# Altium schematic sheet CIBLE_Main.SchDoc
size 151 x 193 mm
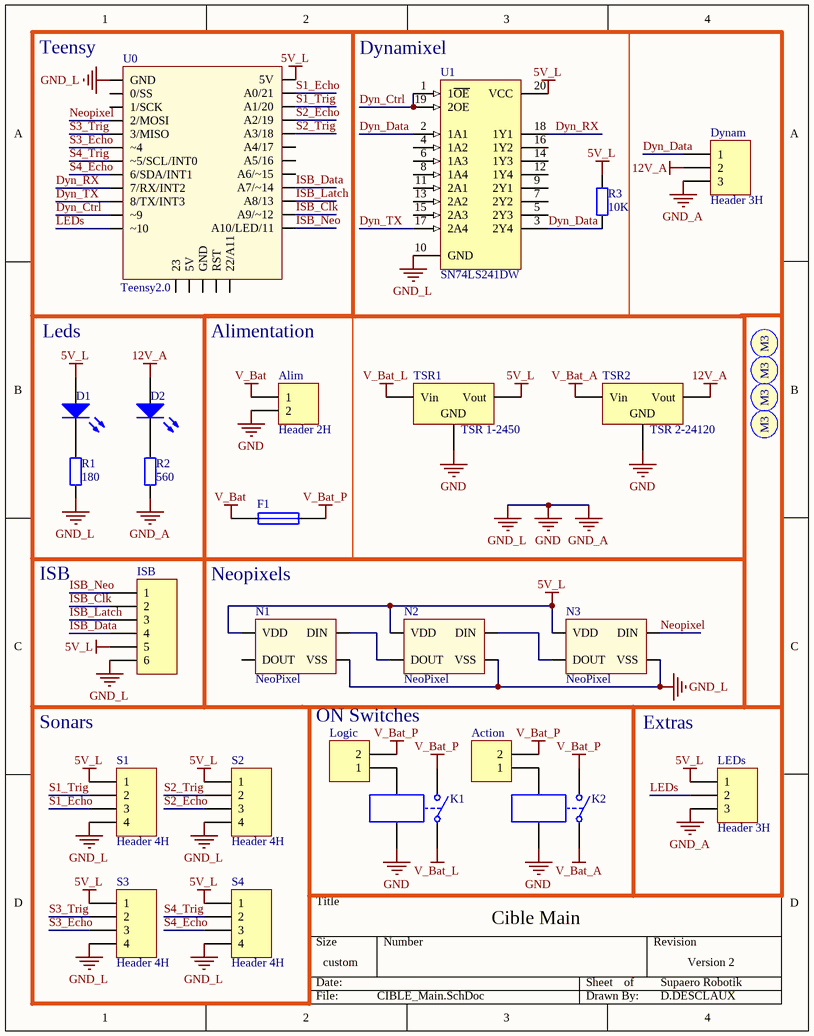
[diagram p0: CIBLE_Main.SchDoc]

## Parts
Action  Action  [Molex SPOX 2x1H]  (value not drawn)
Alim  Header 2H  [Battery SALE]
D1  KP-3216SEC  [3.2X1.6X1.1]  (value not drawn)
D2  KP-3216SEC  [3.2X1.6X1.1]  (value not drawn)
Dynam  Header 3H  [Molex SPOX 3x1H]
F1  Fuse 1  [Fuse]  (value not drawn)
ISB  Header 6H  [MOLEX SPOX 6X1H]  (value not drawn)
K1  OJ-SS-112LMH2  [Relay]  (value not drawn)
K2  OJ-SS-112LMH2  [Relay]  (value not drawn)
LEDs  Header 3H  [Molex SPOX 3x1H]
Logic  Logic  [Molex SPOX 2x1H]  (value not drawn)
N1  NeoPixel  [Neopixel]
N2  NeoPixel  [Neopixel]
N3  NeoPixel  [Neopixel]
R1  value 180  [3.2X1.6X1.1]  (hidden comment: Res2)
R2  value 560  [3.2X1.6X1.1]  (hidden comment: Res2)
R3  value 10K  [3.2X1.6X1.1]  (hidden comment: Res2)
S1  Header 4H  [Molex SPOX 4x1H]
S2  Header 4H  [Molex SPOX 4x1H]
S3  Header 4H  [Molex SPOX 4x1H]
S4  Header 4H  [Molex SPOX 4x1H]
SC1  Screw M3  [Screw M3]  (value not drawn)
SC2  Screw M3  [Screw M3]  (value not drawn)
SC3  Screw M3  [Screw M3]  (value not drawn)
SC4  Screw M3  [Screw M3]  (value not drawn)
TSR1  TSR 1-2450  [TRS]
TSR2  TSR 2-24120  [TRS - centered]
U0  Teensy2.0  [Teensy2.0]
U1  SN74LS241DW  [DW020_N]

## Nets
5V_L: D1.1(A) ISB.5 LEDs.1 N1.4(VDD) N2.4(VDD) N3.4(VDD) R3.2 S1.1 S2.1 S3.1 S4.1 TSR1.3(Vout) U0.29(5V) U1.20(VCC)
12V_A: D2.1(A) Dynam.2 TSR2.3(Vout)
GND: Alim.2 Dynam.3 ISB.6 K1.3 K2.3 LEDs.3 N1.2(VSS) N2.2(VSS) N3.2(VSS) R1.2 R2.2 S1.4 S2.4 S3.4 S4.4 TSR1.2(GND) TSR2.2(GND) U0.1(GND) U1.10(GND)  [also labelled GND_A, GND_L]
V_Bat: Alim.1 F1.1
V_Bat_A: K2.1 TSR2.1(Vin)
V_Bat_L: K1.1 TSR1.1(Vin)
V_Bat_P: Action.2 F1.2 K1.2 K2.2 Logic.2
Dyn_Ctrl: U0.11(~9) U1.1(1~{OE}) U1.19(2OE)
Dyn_Data: Dynam.1 R3.1 U1.2(1A1) U1.3(2Y4)
Dyn_RX: U0.9(7/RX/INT2) U1.18(1Y1)
Dyn_TX: U0.10(8/TX/INT3) U1.17(2A4)
ISB_Clk: ISB.2 U0.19(A9/~12)
ISB_Data: ISB.4 U0.21(A7/~14)
ISB_Latch: ISB.3 U0.20(A8/13)
ISB_Neo: ISB.1 U0.18(A10/LED/11)
LEDs: LEDs.2 U0.12(~10)
Neopixel: N3.3(DIN) U0.4(2/MOSI)
S1_Echo: S1.3 U0.28(A0/21)
S1_Trig: S1.2 U0.27(A1/20)
S2_Echo: S2.3 U0.26(A2/19)
S2_Trig: S2.2 U0.25(A3/18)
S3_Echo: S3.3 U0.6(~4)
S3_Trig: S3.2 U0.5(3/MISO)
S4_Echo: S4.3 U0.8(6/SDA/INT1)
S4_Trig: S4.2 U0.7(~5/SCL/INT0)
NetAction_1: Action.1 K2.4
NetD1_2: D1.2(K) R1.1
NetD2_2: D2.2(K) R2.1
NetK1_4: K1.4 Logic.1
NetN1_3: N1.3(DIN) N2.1(DOUT)
NetN2_3: N2.3(DIN) N3.1(DOUT)

Not connected (* = marked no-connect by the designer): N1 1(DOUT); U0 2(0/SS) 3(1/SCK) 13(23) 14(5V) 15(GND) 16(RST) 17(22/A11) 22(A6/~15) 23(A5/16) 24(A4/17); U1 4(1A2) 5(2Y3) 6(1A3) 7(2Y2) 8(1A4) 9(2Y1) 11(2A1) 12(1Y4) 13(2A2) 14(1Y3) 15(2A3) 16(1Y2)

## Notes on the sheet
- (near U0) Teensy
- (near U1) Dynamixel
- Leds
- Alimentation
- ISB
- Neopixels
- Sonars
- (near Logic) ON Switches
- Extras
- Cible Main
- Supaero Robotik
- Version 2
- D.DESCLAUX
- (in symbol Screw M3) M3

## Library data of the parts
Action Alim Logic = Header 2H: Header, 2-Pin, Right Angle; LatestRevisionDate: 17-Jul-2002; LatestRevisionNote: Re-released for DXP Platform.; Publisher: Altium Limited
D1 D2 = LED2: Typical RED, GREEN, YELLOW, AMBER GaAs LED; Published: 8-Jun-2000; LatestRevisionDate: 17-Jul-2002; LatestRevisionNote: Re-released for DXP Platform.; PackageVersion: Feb-2002; PackageReference: 3.2X1.6X1.1; Publisher: Altium Limited; PackageDescription: SM LED; 2 Flat Leads
Dynam LEDs = Header 3H: Header, 3-Pin, Right Angle; LatestRevisionDate: 17-Jul-2002; LatestRevisionNote: Re-released for DXP Platform.; Publisher: Altium Limited
F1 = Fuse 1: Fuse; Published: 8-Jun-2000; LatestRevisionDate: 17-Jul-2002; LatestRevisionNote: Re-released for DXP Platform.; PackageReference: PIN-W2/E2.8; Publisher: Altium Limited; PackageDescription: Thru-Hole; 2 Leads
ISB = Header 6H: Header, 6-Pin, Right Angle; LatestRevisionDate: 17-Jul-2002; LatestRevisionNote: Re-released for DXP Platform.; Publisher: Altium Limited
K1 K2 = Relay-SPST: Single-Pole Single-Throw Relay; Published: 24-Mar-1999; LatestRevisionDate: 17-Jul-2002; LatestRevisionNote: Re-released for DXP Platform.; PackageReference: MODULE4; Publisher: Altium Limited
N1-N3 = NeoPixel: pin to pad: 1>4 2>1 3>2 4>3
R1-R3 = Res2: Resistor; Published: 8-Jun-2000; LatestRevisionDate: 17-Jul-2002; LatestRevisionNote: Re-released for DXP Platform.; PackageReference: AXIAL-0.4; Publisher: Altium Limited; PackageDescription: Axial Device, Thru-Hole; 2 Leads; 0.4 in Pin Spacing
S1-S4 = Header 4H: Header, 4-Pin, Right Angle; LatestRevisionDate: 17-Jul-2002; LatestRevisionNote: Re-released for DXP Platform.; Publisher: Altium Limited
TSR1 TSR2 = Volt Reg: Voltage Regulator; Published: 24-Mar-1999; LatestRevisionDate: 29-May-2009; LatestRevisionNote: IPC-7351 Footprint Added.; PackageReference: D2PAK; Publisher: Altium Limited; PackageDescription: 3-Pin Transistor Outline Package 2.54 mm Pitch, 15.1 mm Lead Span
U0 = Teensy2.0: Teensy 2.0 with minimal pinout
U1 = SN74LS241DW: Octal Buffer and Line Driver with 3-State Outputs; ComponentAvailability: Obsolete; Published: 8-Jun-2000; LatestRevisionDate: 13-Apr-2006; LatestRevisionNote: IPC-7351 Footprint Added.; DatasheetVersion: Mar-1988; PackageVersion: Mar-2000; PackageReference: DW020; Publisher: Altium Limited; PackageDescription: 20-Pin Plastic Small Outline Integrated Circuit 1.27 mm Pitch; Code_JEDEC: MS-013; Code_IPC: SOIC127P1030-20; ComponentLink1Description: Manufacturer Link; ComponentLink1URL: http://www.ti.com/; ComponentLink2Description: Datasheet; ComponentLink2URL: http://www-s.ti.com/sc/ds/sn74ls240.pdf